# EAGLE design Sensor3 (EAGLE 9.3.0)
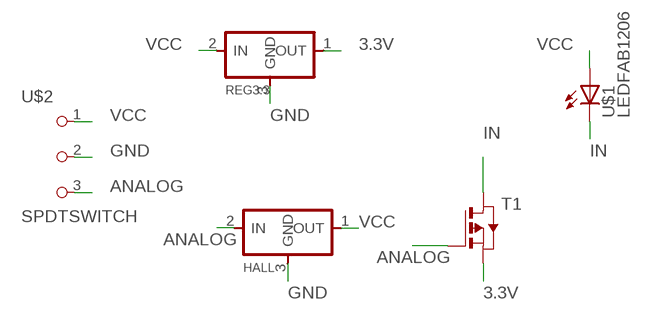
[diagram p0: schematic, sheet 1]

## Parts
HALL  REGULATORSOT23  [SOT23]
REG3.3  REGULATORSOT23  [SOT23]
T1  PMOSFETSOT23  [SOT-23]
U$1  LEDFAB1206  [LED1206FAB]
U$2  SPDTSWITCH  [SPDTSWITCH]

## Nets
3.3V: REG3.3.1(OUT) T1.2(S)
ANALOG: HALL.2(IN) T1.3(G) U$2.3
GND: HALL.3(GND) REG3.3.3(GND) U$2.2
IN: T1.1(D) U$1.2(C)
VCC: HALL.1(OUT) REG3.3.2(IN) U$1.1(A) U$2.1

## Library data of the parts
HALL REG3.3 = fab:REGULATOR
T1 = fab:PMOSFET: MOS FET
U$1 = fab:LED: LED
U$2 = fab:SPDTSWITCH

## Board
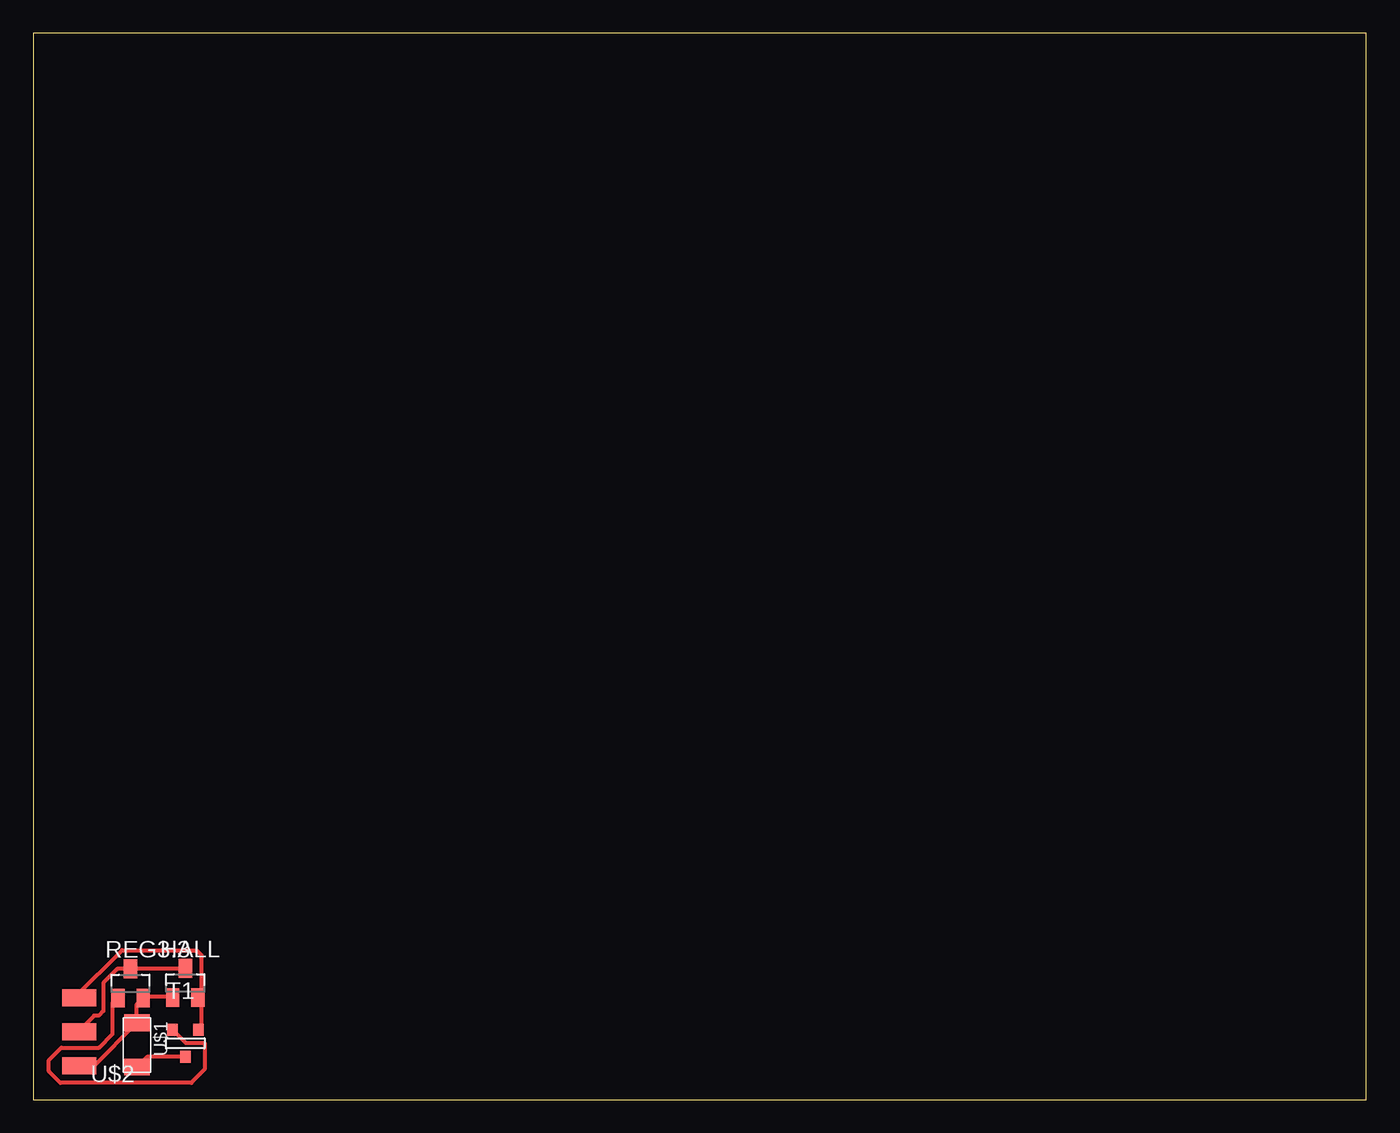
[diagram p1: board, top side]

Size 100 x 80 mm. Coordinates in mm from the lower left corner, seen from the top.
Outline: 0,0 100,0 100,80 0,80 0,0
Copper layers (1*16): Top 0.035mm / dielectric 1.5mm / Bottom 0.035mm
Design rules "default *": minimum track width 0.3mm, minimum drill 0.03125mm, track to track 0.4mm, track to pad 0.4mm, pad to pad 0.4mm, via to via 0.4mm, smd to smd 0.4mm, copper to edge 40mil, drill to drill 6mil, minimum pad ring 10mil, minimum via ring 8mil, stop-mask expansion 4mil, vias tented up to drill 0mil, thermal gap 10mil

### Footprints (pad centres in the part's own frame; a part is rotated, then mirrored left to right if it is on the bottom)
SOT23 = smd 1 x 1.4: 1 -0.95,-1.1; 2 0.95,-1.1; 3 0,1.1
SOT-23 = smd 0.787 x 0.889: 1 0.025,-1.016; 2 -0.94,1.016; 3 0.991,1.016
LED1206FAB = smd 1.27 x 1.905: 1 -1.651,0; 2 1.651,0
SPDTSWITCH = smd 2.54 x 1.27: 1 0.38,2.54; 2 0.38,0; 3 0.38,-2.54

### Placement (x,y rotation side)
HALL  11.4,8.74 0 top
REG3.3  7.29,8.71 0 top
T1  11.38,4.22 0 top
U$1  7.77,4.09 270 top
U$2  3.81,5.08 180 top

### Tracks (layer width: path | path; a pad name or v marks a point on that pad's centre or on a via)
3.3V
  Top 0.3: T1.2 11.43,4.24 12.85,4.24 12.85,2.26 11.85,1.25 2.03,1.25 1.17,2.12 1.17,2.96 2.1,3.9 4.93,3.9 5.95,4.92 5.95,7.22 REG3.3.1
ANALOG
  Top 0.3: T1.3 12.6,5.25 12.6,7.35 HALL.2 12.6,7.7 12.6,10.85 12.25,11.2 6.65,11.2 3.15,7.7 U$2.3
GND
  Top 0.3: HALL.3 11.2,9.8 7.35,9.8 REG3.3.3 7,9.8 6.3,9.8 5.25,8.75 5.25,6.65 4.9,6.3 4.55,6.3 3.5,5.25 U$2.2
IN
  Top 0.3: T1.1 8.53,3.2 U$1.2
VCC
  Top 0.3: HALL.1 10.15,7.7 8.4,7.7 REG3.3.2 7.77,7.14 U$1.1 4.57,2.54 U$2.1